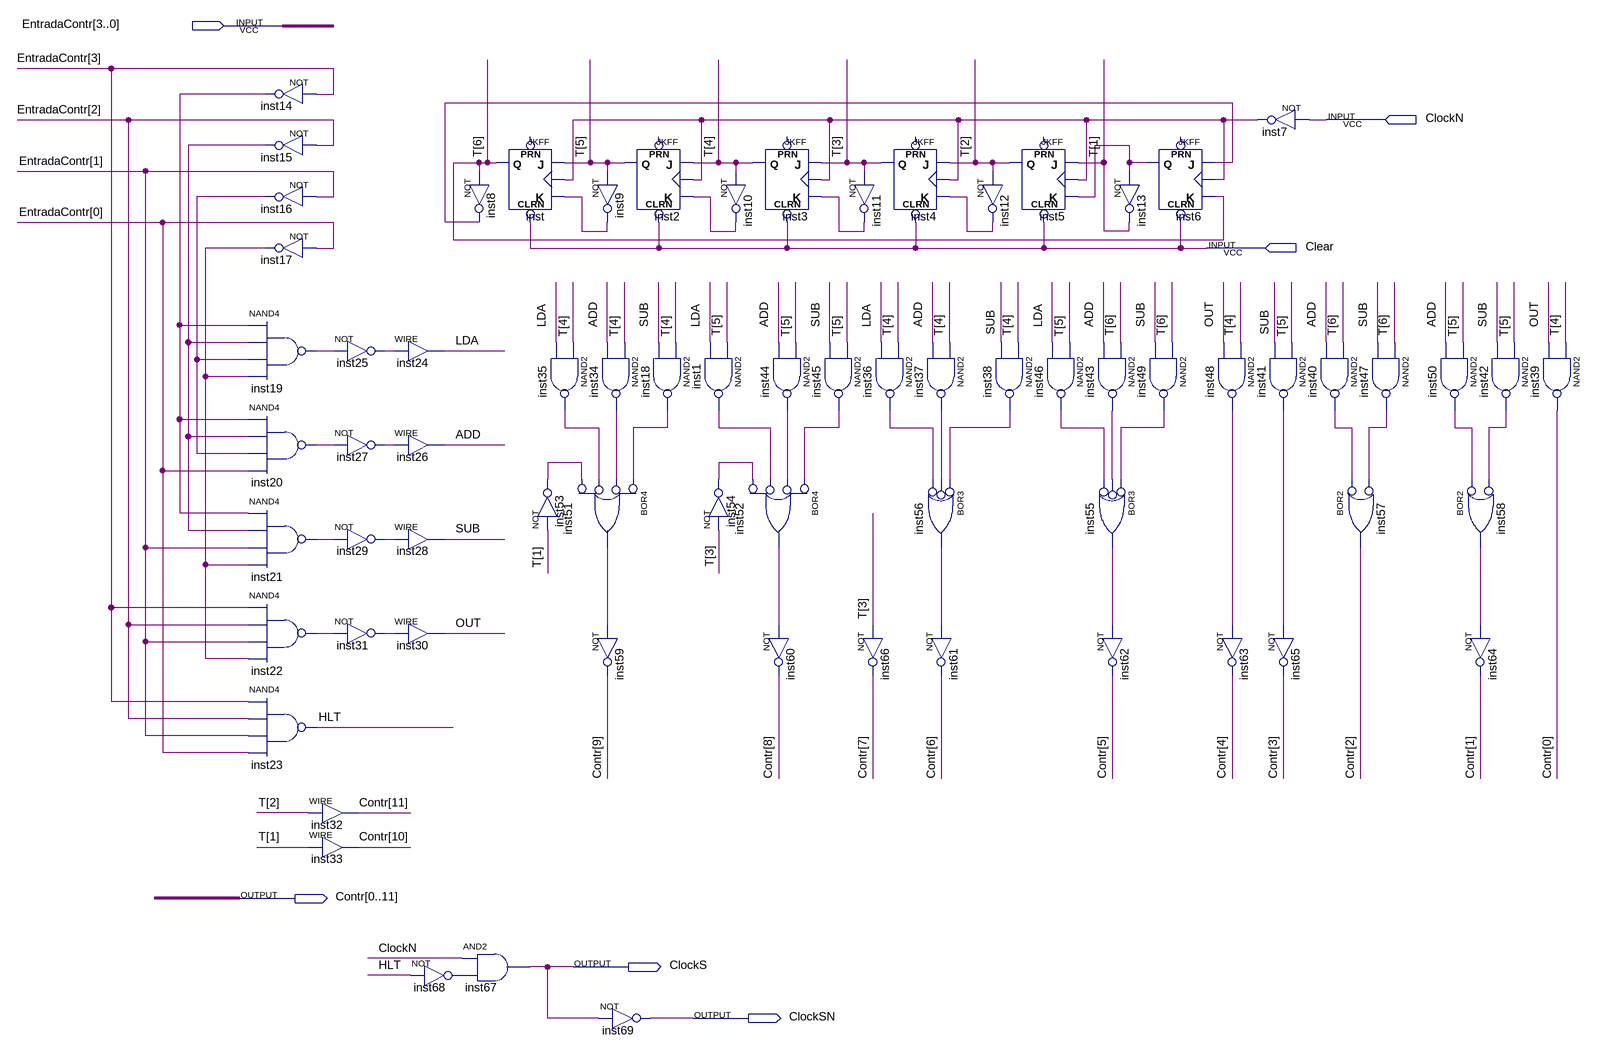
[diagram p0: schematic sheet]
// Quartus schematic Controlador_sequenciador.bdf as structural Verilog: 70 symbols, 6 pins
module Controlador_sequenciador (
  input  [3:0] EntradaContr,
  input  ClockN,
  input  Clear,
  output [0:11] Contr,
  output ClockS,
  output ClockSN
);

  wire ADD, HLT, inst1_out, inst6_q, inst7_out, inst8_out, inst9_out, inst10_out, inst11_out, inst12_out,
       inst14_out, inst15_out, inst16_out, inst17_out, inst18_out, inst19_out, inst20_out, inst21_out,
       inst22_out, inst25_out, inst27_out, inst29_out, inst31_out, inst34_out, inst35_out, inst36_out,
       inst37_out, inst38_out, inst40_out, inst41_out, inst42_out, inst43_out, inst44_out, inst45_out,
       inst46_out, inst47_out, inst48_out, inst49_out, inst50_out, inst51_out, inst52_out, inst53_out,
       inst54_out, inst55_out, inst56_out, inst58_out, inst68_out, LDA, OUT, SUB;
  wire [6:1] T;

  nand inst19 (inst19_out, inst14_out, inst15_out, inst16_out, inst17_out);
  nand inst20 (inst20_out, inst14_out, inst15_out, inst16_out, EntradaContr[0]);
  nand inst21 (inst21_out, inst14_out, inst15_out, EntradaContr[1], inst17_out);
  nand inst22 (inst22_out, EntradaContr[3], EntradaContr[2], EntradaContr[1], inst17_out);
  nand inst23 (HLT, EntradaContr[3], EntradaContr[2], EntradaContr[1], EntradaContr[0]);
  not inst14 (inst14_out, EntradaContr[3]);
  not inst15 (inst15_out, EntradaContr[2]);
  not inst16 (inst16_out, EntradaContr[1]);
  not inst17 (inst17_out, EntradaContr[0]);
  assign Contr[11] = T[2];  // WIRE inst32
  assign Contr[10] = T[1];  // WIRE inst33
  not inst25 (inst25_out, inst19_out);
  not inst27 (inst27_out, inst20_out);
  not inst29 (inst29_out, inst21_out);
  not inst31 (inst31_out, inst22_out);
  assign LDA = inst25_out;  // WIRE inst24
  assign ADD = inst27_out;  // WIRE inst26
  assign SUB = inst29_out;  // WIRE inst28
  assign OUT = inst31_out;  // WIRE inst30
  not inst68 (inst68_out, HLT);
  JKFF inst (.CLRN(Clear), .K(inst9_out), .J(T[5]), .CLK(inst7_out), .Q(T[6]));  // open: PRN
  not inst8 (inst8_out, T[6]);
  and inst67 (ClockS, ClockN, inst68_out);
  not inst9 (inst9_out, T[5]);
  nand inst34 (inst34_out, T[4], ADD);
  nand inst35 (inst35_out, T[4], LDA);
  or inst51 (inst51_out, ~inst18_out, ~inst34_out, ~inst35_out, ~inst53_out);  // BOR4
  not inst53 (inst53_out, T[1]);
  not inst59 (Contr[9], inst51_out);
  JKFF inst2 (.CLRN(Clear), .K(inst10_out), .J(T[4]), .CLK(inst7_out), .Q(T[5]));  // open: PRN
  nand inst18 (inst18_out, T[4], SUB);
  not inst69 (ClockSN, ClockS);
  not inst10 (inst10_out, T[4]);
  nand inst1 (inst1_out, T[5], LDA);
  not inst54 (inst54_out, T[3]);
  JKFF inst3 (.CLRN(Clear), .K(inst11_out), .J(T[3]), .CLK(inst7_out), .Q(T[4]));  // open: PRN
  nand inst44 (inst44_out, T[5], ADD);
  or inst52 (inst52_out, ~inst45_out, ~inst44_out, ~inst1_out, ~inst54_out);  // BOR4
  not inst60 (Contr[8], inst52_out);
  not inst11 (inst11_out, T[3]);
  nand inst36 (inst36_out, T[4], LDA);
  nand inst45 (inst45_out, T[5], SUB);
  not inst66 (Contr[7], T[3]);
  JKFF inst4 (.CLRN(Clear), .K(inst12_out), .J(T[2]), .CLK(inst7_out), .Q(T[3]));  // open: PRN
  nand inst37 (inst37_out, T[4], ADD);
  or inst56 (inst56_out, ~inst38_out, ~inst37_out, ~inst36_out);  // BOR3
  not inst61 (Contr[6], inst56_out);
  not inst12 (inst12_out, T[2]);
  nand inst38 (inst38_out, T[4], SUB);
  JKFF inst5 (.CLRN(Clear), .K(inst6_q), .J(T[1]), .CLK(inst7_out), .Q(T[2]));  // open: PRN
  nand inst46 (inst46_out, T[5], LDA);
  not inst13 (T[1], inst6_q);
  nand inst43 (inst43_out, T[6], ADD);
  nand inst49 (inst49_out, T[6], SUB);
  or inst55 (inst55_out, ~inst49_out, ~inst43_out, ~inst46_out);  // BOR3
  not inst62 (Contr[5], inst55_out);
  JKFF inst6 (.CLRN(Clear), .K(T[6]), .J(inst8_out), .CLK(inst7_out), .Q(inst6_q));  // open: PRN
  nand inst48 (inst48_out, T[4], OUT);
  not inst7 (inst7_out, ClockN);
  nand inst41 (inst41_out, T[5], SUB);
  not inst63 (Contr[4], inst48_out);
  not inst65 (Contr[3], inst41_out);
  nand inst40 (inst40_out, T[6], ADD);
  or inst57 (Contr[2], ~inst40_out, ~inst47_out);  // BOR2
  nand inst47 (inst47_out, T[6], SUB);
  nand inst42 (inst42_out, T[5], SUB);
  nand inst50 (inst50_out, T[5], ADD);
  or inst58 (inst58_out, ~inst50_out, ~inst42_out);  // BOR2
  not inst64 (Contr[1], inst58_out);
  nand inst39 (Contr[0], T[4], OUT);
endmodule
